# Altium schematic sheet Top.SchDoc
size A4; SheetNumber: 1; SheetTotal: 3
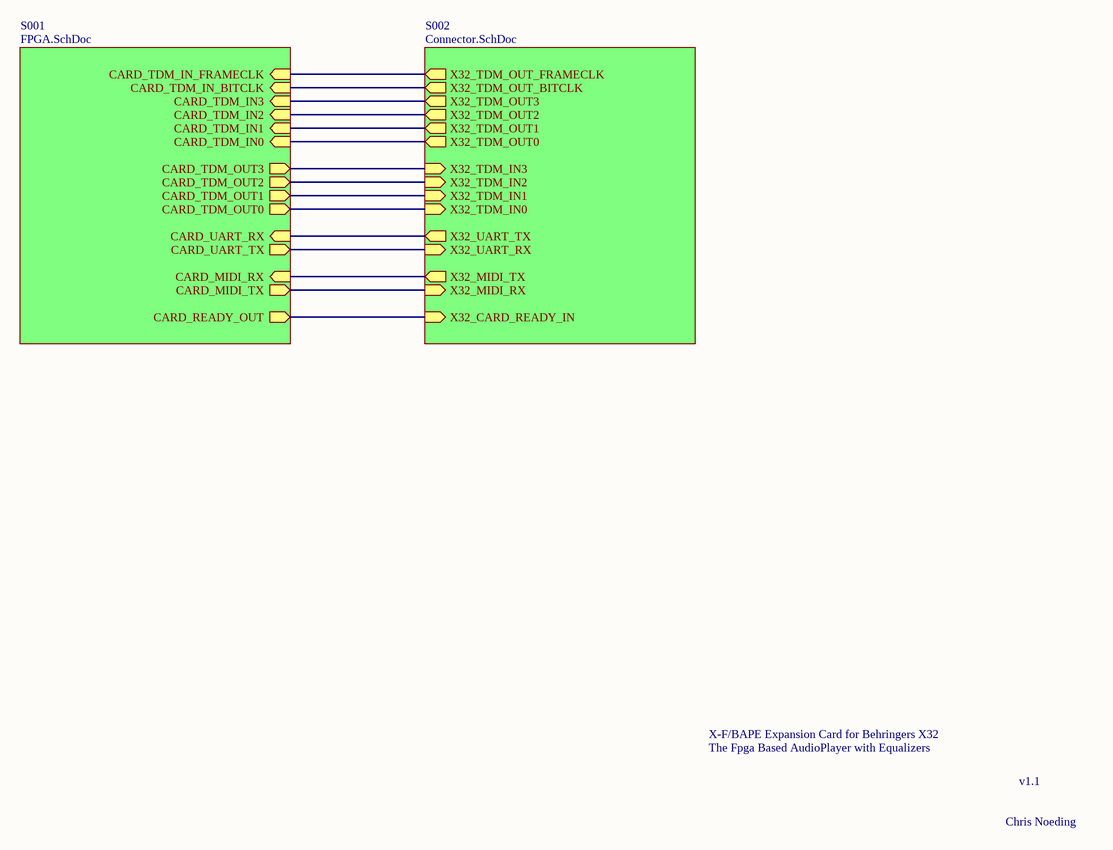
[diagram p0: Top.SchDoc]

## Sub-sheets
S001 = FPGA.SchDoc: CARD_TDM_IN_FRAMECLK (in), CARD_TDM_IN_BITCLK (in), CARD_TDM_IN3 (in), CARD_TDM_IN2 (in), CARD_TDM_IN1 (in), CARD_TDM_IN0 (in), CARD_TDM_OUT3 (out), CARD_TDM_OUT2 (out), CARD_TDM_OUT1 (out), CARD_TDM_OUT0 (out), CARD_UART_RX (in), CARD_UART_TX (out), CARD_MIDI_RX (in), CARD_MIDI_TX (out), CARD_READY_OUT (out)
S002 = Connector.SchDoc: X32_TDM_OUT_FRAMECLK (out), X32_TDM_OUT_BITCLK (out), X32_TDM_OUT3 (out), X32_TDM_OUT2 (out), X32_TDM_OUT1 (out), X32_TDM_OUT0 (out), X32_TDM_IN3 (in), X32_TDM_IN2 (in), X32_TDM_IN1 (in), X32_TDM_IN0 (in), X32_UART_TX (out), X32_UART_RX (in), X32_MIDI_TX (out), X32_MIDI_RX (in), X32_CARD_READY_IN (in)

## Nets
(unnamed): sheet S001/CARD_TDM_IN_FRAMECLK, sheet S002/X32_TDM_OUT_FRAMECLK
(unnamed): sheet S001/CARD_TDM_IN_BITCLK, sheet S002/X32_TDM_OUT_BITCLK
(unnamed): sheet S001/CARD_TDM_IN3, sheet S002/X32_TDM_OUT3
(unnamed): sheet S001/CARD_TDM_IN2, sheet S002/X32_TDM_OUT2
(unnamed): sheet S001/CARD_TDM_IN1, sheet S002/X32_TDM_OUT1
(unnamed): sheet S001/CARD_TDM_IN0, sheet S002/X32_TDM_OUT0
(unnamed): sheet S001/CARD_TDM_OUT3, sheet S002/X32_TDM_IN3
(unnamed): sheet S001/CARD_TDM_OUT2, sheet S002/X32_TDM_IN2
(unnamed): sheet S001/CARD_TDM_OUT1, sheet S002/X32_TDM_IN1
(unnamed): sheet S001/CARD_TDM_OUT0, sheet S002/X32_TDM_IN0
(unnamed): sheet S001/CARD_UART_RX, sheet S002/X32_UART_TX
(unnamed): sheet S001/CARD_UART_TX, sheet S002/X32_UART_RX
(unnamed): sheet S001/CARD_MIDI_RX, sheet S002/X32_MIDI_TX
(unnamed): sheet S001/CARD_MIDI_TX, sheet S002/X32_MIDI_RX
(unnamed): sheet S001/CARD_READY_OUT, sheet S002/X32_CARD_READY_IN

## Notes on the sheet
- X-F/BAPE Expansion Card for Behringers X32
- The Fpga Based AudioPlayer with Equalizers
- v1.1
- Chris Noeding